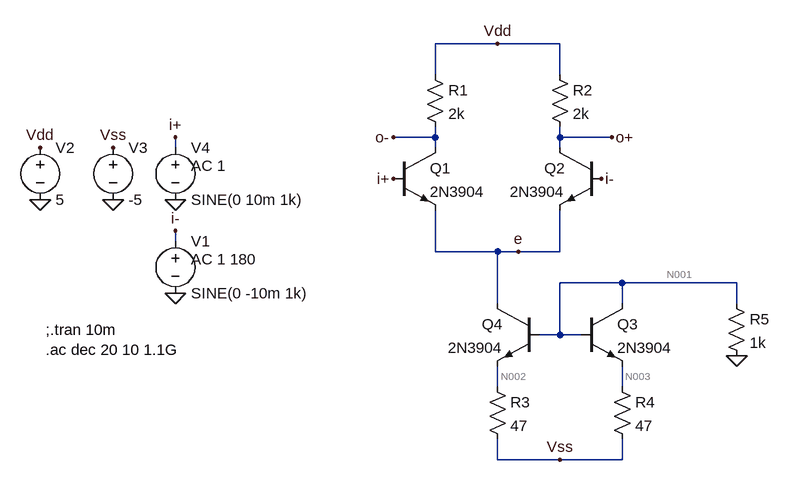
[diagram p0: schematic fig1-a.asc]
fig1-a.asc, the LTspice schematic file:
Version 4
SHEET 1 1288 680
WIRE 272 -320 176 -320
WIRE 368 -320 272 -320
WIRE 176 -272 176 -320
WIRE 368 -272 368 -320
WIRE 176 -176 176 -192
WIRE 176 -176 112 -176
WIRE 368 -176 368 -192
WIRE 448 -176 368 -176
WIRE -224 -160 -224 -176
WIRE 176 -160 176 -176
WIRE 368 -160 368 -176
WIRE -224 -16 -224 -32
WIRE 176 0 176 -64
WIRE 272 0 176 0
WIRE 304 0 272 0
WIRE 368 0 368 -64
WIRE 368 0 304 0
WIRE 464 48 368 48
WIRE 640 48 464 48
WIRE 272 80 272 0
WIRE 464 80 464 48
WIRE 640 80 640 48
WIRE 368 128 368 48
WIRE 368 128 336 128
WIRE 400 128 368 128
WIRE 272 208 272 176
WIRE 464 208 464 176
WIRE 272 320 272 288
WIRE 368 320 272 320
WIRE 464 320 464 288
WIRE 464 320 368 320
FLAG -224 64 0
FLAG -432 -80 0
FLAG -224 -32 i-
FLAG -432 -160 Vdd
FLAG -320 -80 0
FLAG -320 -160 Vss
FLAG -224 -80 0
FLAG -224 -176 i+
FLAG 640 160 0
FLAG 368 320 Vss
FLAG 304 0 e
FLAG 272 -320 Vdd
FLAG 432 -112 i-
FLAG 112 -112 i+
FLAG 448 -176 o+
FLAG 112 -176 o-
SYMBOL voltage -224 -32 R0
WINDOW 123 24 44 Left 2
WINDOW 39 0 0 Left 0
SYMATTR Value2 AC 1 180
SYMATTR InstName V1
SYMATTR Value SINE(0 -10m 1k)
SYMBOL voltage -432 -176 R0
WINDOW 123 0 0 Left 0
WINDOW 39 0 0 Left 0
SYMATTR InstName V2
SYMATTR Value 5
SYMBOL npn 112 -160 R0
SYMATTR InstName Q1
SYMATTR Value 2N3904
SYMBOL voltage -320 -176 R0
WINDOW 123 0 0 Left 0
WINDOW 39 0 0 Left 0
SYMATTR InstName V3
SYMATTR Value -5
SYMBOL voltage -224 -176 R0
WINDOW 123 24 44 Left 2
WINDOW 39 0 0 Left 0
SYMATTR Value2 AC 1
SYMATTR InstName V4
SYMATTR Value SINE(0 10m 1k)
SYMBOL npn 432 -160 M0
SYMATTR InstName Q2
SYMATTR Value 2N3904
SYMBOL npn 400 80 R0
SYMATTR InstName Q3
SYMATTR Value 2N3904
SYMBOL npn 336 80 M0
SYMATTR InstName Q4
SYMATTR Value 2N3904
SYMBOL res 160 -288 R0
SYMATTR InstName R1
SYMATTR Value 2k
SYMBOL res 352 -288 R0
SYMATTR InstName R2
SYMATTR Value 2k
SYMBOL res 256 192 R0
SYMATTR InstName R3
SYMATTR Value 47
SYMBOL res 448 192 R0
SYMATTR InstName R4
SYMATTR Value 47
SYMBOL res 624 64 R0
SYMATTR InstName R5
SYMATTR Value 1k
TEXT -424 120 Left 2 !;.tran 10m\n.ac dec 20 10 1.1G

The netlist it stands for:
* fig1-a.asc
V1 i- 0 SINE(0 -10m 1k) AC 1 180
V2 Vdd 0 5
Q1 o- i+ e 0 2N3904
V3 Vss 0 -5
V4 i+ 0 SINE(0 10m 1k) AC 1
Q2 o+ i- e 0 2N3904
Q3 N001 N001 N003 0 2N3904
Q4 e N001 N002 0 2N3904
R1 Vdd o- 2k
R2 Vdd o+ 2k
R3 N002 Vss 47
R4 N003 Vss 47
R5 N001 0 1k
.model NPN NPN
.model PNP PNP
.lib standard.bjt
;.tran 10m
.ac dec 20 10 1.1G
.backanno
.end

* Results of the author's LTspice run, read from the files saved beside the schematic
* Operating Point, zero values left out:
*   V(vdd) = 5 V
*   V(o-) = 908.9 mV
*   V(e) = -673.9 mV
*   V(vss) = -5 V
*   V(o+) = 908.9 mV
*   V(n001) = -4.115 V
*   V(n003) = -4.807 V
*   V(n002) = -4.806 V
*   Ic(Q4) = 4.105 mA
*   Ib(Q4) = 13.36 µA
*   Ie(Q4) = -4.118 mA
*   Ic(Q3) = 4.088 mA
*   Ib(Q3) = 13.76 µA
*   Ie(Q3) = -4.101 mA
*   Ic(Q2) = 2.046 mA
*   Ib(Q2) = 6.791 µA
*   Ie(Q2) = -2.052 mA
*   Ic(Q1) = 2.046 mA
*   Ib(Q1) = 6.791 µA
*   Ie(Q1) = -2.052 mA
*   I(R5) = -4.115 mA
*   I(R4) = 4.101 mA
*   I(R3) = 4.118 mA
*   I(R2) = 2.046 mA
*   I(R1) = 2.046 mA
*   I(V4) = -6.791 µA
*   I(V3) = 8.219 mA
*   I(V2) = -4.091 mA
*   I(V1) = -6.791 µA